# EAGLE board Prototyping-Board (EAGLE 5.11)
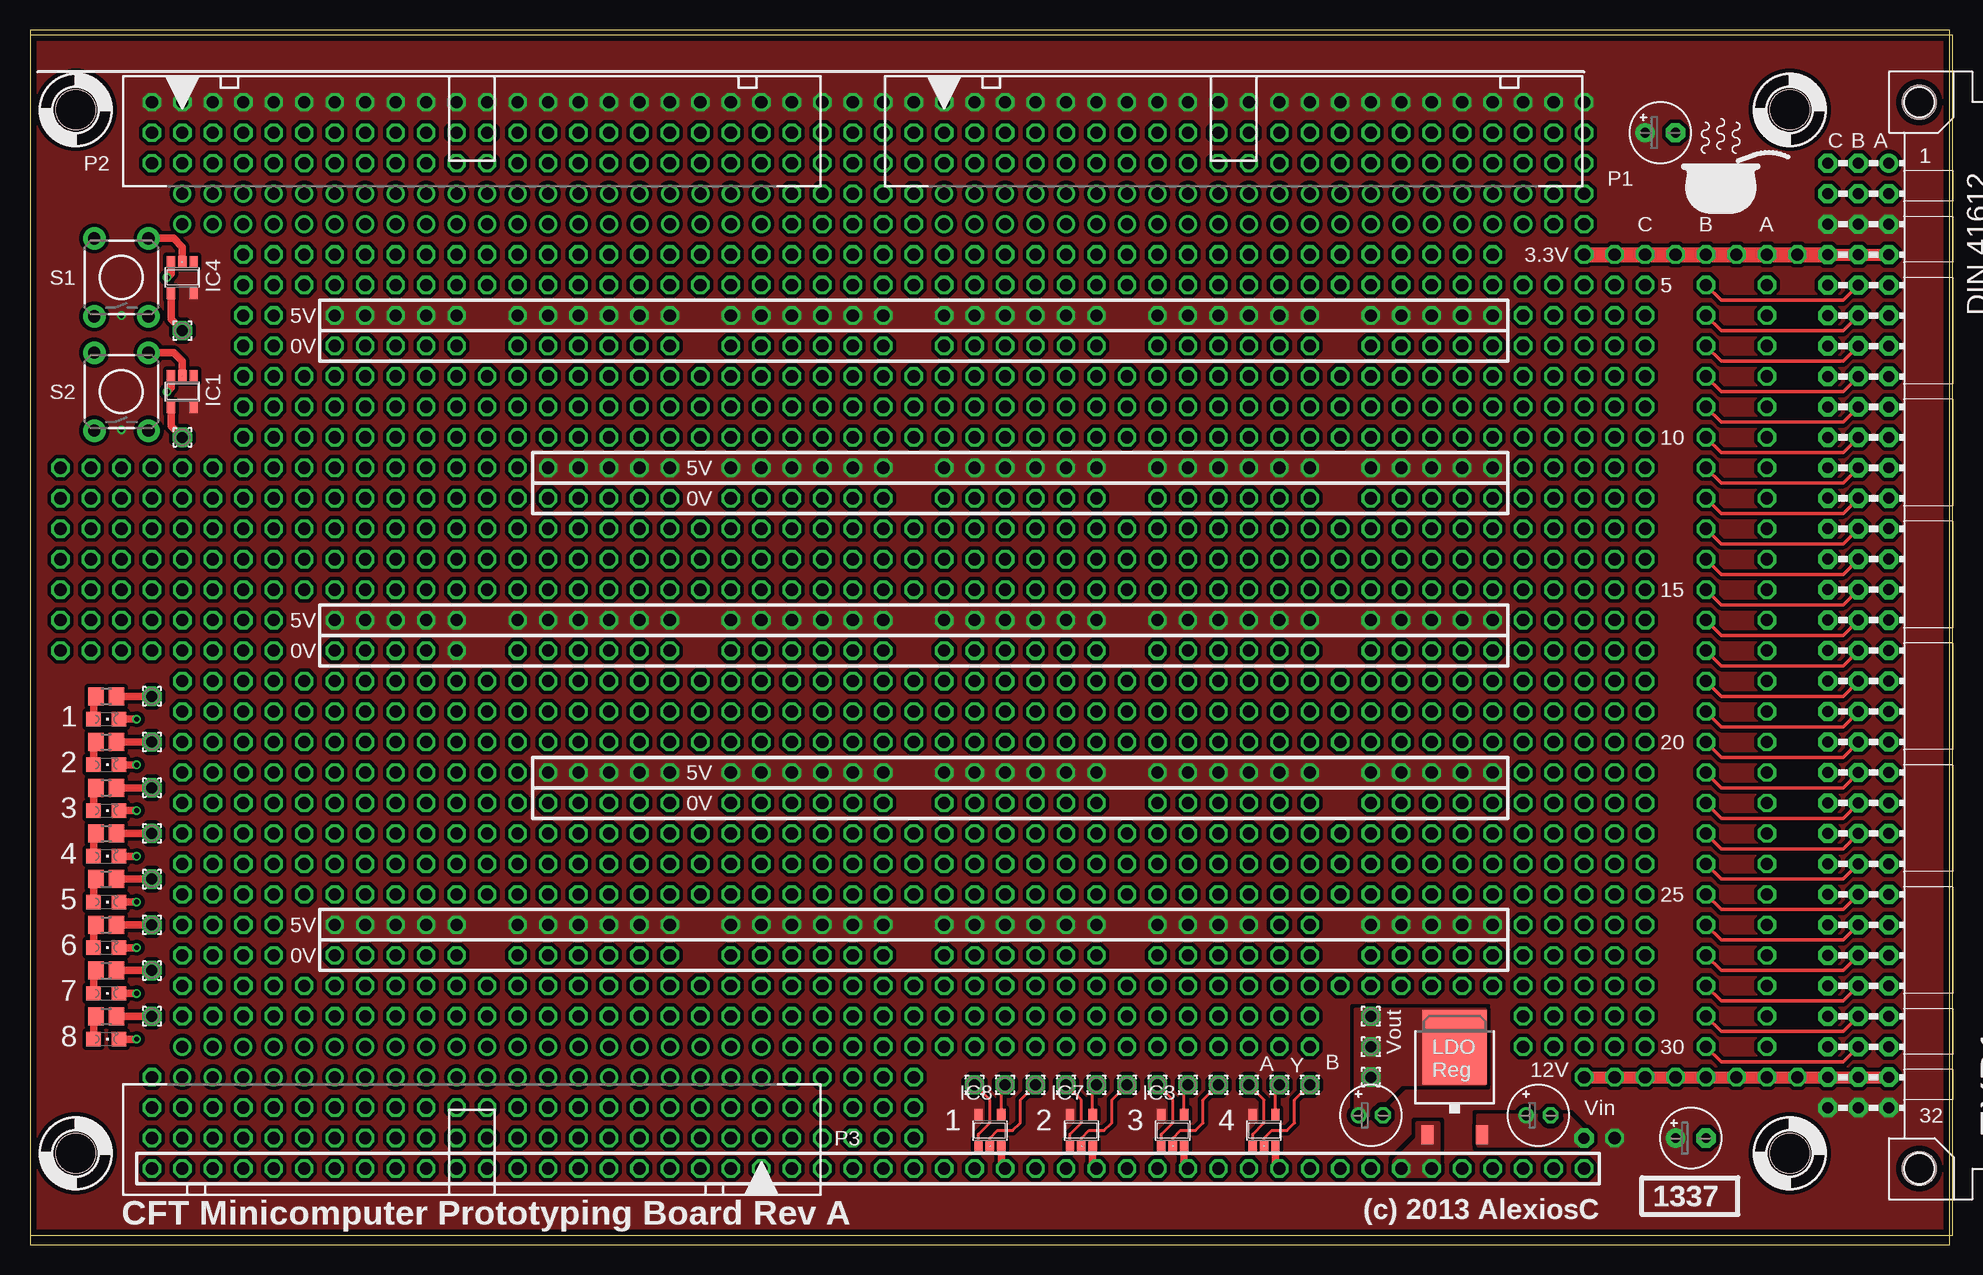
[diagram p5: board, top side]
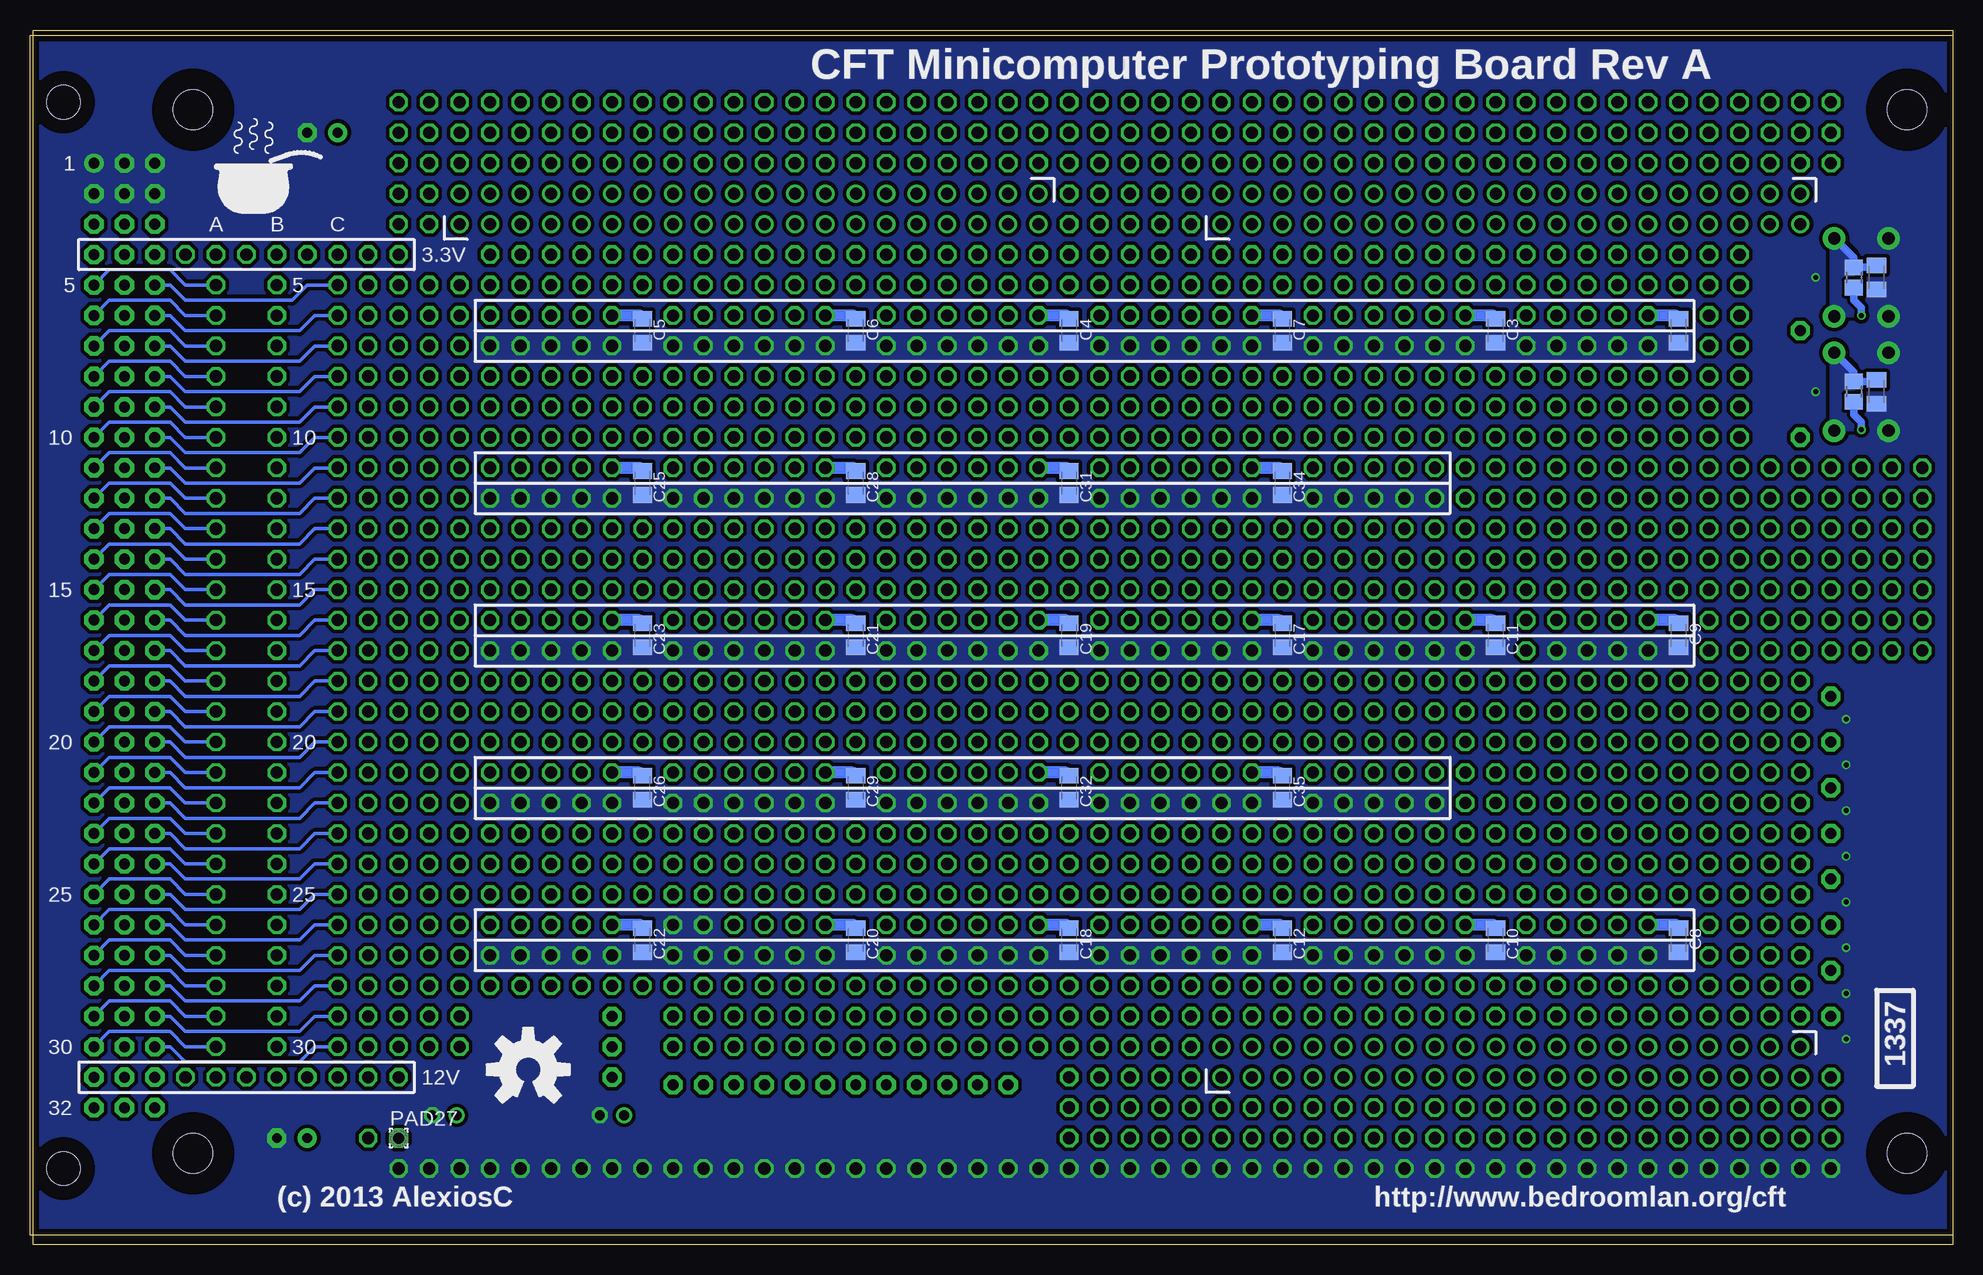
[diagram p6: board, bottom side, seen from below]

Size 160 x 101.27 mm. Coordinates in mm from the lower left corner, seen from the top.
Outline: 0,0 160,0 160,101.27 0,101.27 0,0
Copper layers (1*16): Top 0.035mm / dielectric 1.5mm / Bottom 0.035mm
Design rules "smart-prototyping *": minimum track width 7mil, minimum drill 12mil, track to track 7mil, track to pad 7mil, pad to pad 7mil, via to via 7mil, smd to smd 0mil, copper to edge 20mil, drill to drill 10mil, minimum pad ring 10mil, minimum via ring 6mil, stop-mask expansion 2mil, vias tented up to drill 25mil, thermal gap 10mil
Net classes: 0 default: width 0.254 mm, clearance 0.152 mm; 1 low power: width 0.254 mm, clearance 0.152 mm; 2 Power rails: width 0.61 mm, clearance 0.152 mm

## Footprints (pad centres in the part's own frame; a part is rotated, then mirrored left to right if it is on the bottom)
C0805K = smd 1.3 x 1.6: 1 -1,0; 2 1,0
E2,5-5 = drill 0.813 pad 1.6 round: + -1.27,0 | drill 0.813 pad 1.6 octagon: - 1.27,0
E2-5 = drill 0.813 pad 1.27 round: + -1.016,0 | drill 0.813 pad 1.27 octagon: - 1.016,0
VG96K = drill 0.914 pad 1.6 round: A1 154.94,39.37 | drill 0.914 pad 1.6 octagon: A2 154.94,36.83; A3 154.94,34.29; A4 154.94,31.75; A5 154.94,29.21; A6 154.94,26.67; A7 154.94,24.13; A8 154.94,21.59; A9 154.94,19.05; A10 154.94,16.51; A11 154.94,13.97; A12 154.94,11.43; A13 154.94,8.89; A14 154.94,6.35; A15 154.94,3.81; A16 154.94,1.27; A17 154.94,-1.27; A18 154.94,-3.81; A19 154.94,-6.35; A20 154.94,-8.89; A21 154.94,-11.43; A22 154.94,-13.97; A23 154.94,-16.51; A24 154.94,-19.05; A25 154.94,-21.59; A26 154.94,-24.13; A27 154.94,-26.67; A28 154.94,-29.21; A29 154.94,-31.75; A30 154.94,-34.29; A31 154.94,-36.83; A32 154.94,-39.37; B1 152.4,39.37; B2 152.4,36.83; B3 152.4,34.29; B4 152.4,31.75; B5 152.4,29.21; B6 152.4,26.67; B7 152.4,24.13; B8 152.4,21.59; B9 152.4,19.05; B10 152.4,16.51; B11 152.4,13.97; B12 152.4,11.43; B13 152.4,8.89; B14 152.4,6.35; B15 152.4,3.81; B16 152.4,1.27; B17 152.4,-1.27; B18 152.4,-3.81; B19 152.4,-6.35; B20 152.4,-8.89; B21 152.4,-11.43; B22 152.4,-13.97; B23 152.4,-16.51; B24 152.4,-19.05; B25 152.4,-21.59; B26 152.4,-24.13; B27 152.4,-26.67; B28 152.4,-29.21; B29 152.4,-31.75; B30 152.4,-34.29; B31 152.4,-36.83; B32 152.4,-39.37; C1 149.86,39.37; C2 149.86,36.83; C3 149.86,34.29; C4 149.86,31.75; C5 149.86,29.21; C6 149.86,26.67; C7 149.86,24.13; C8 149.86,21.59; C9 149.86,19.05; C10 149.86,16.51; C11 149.86,13.97; C12 149.86,11.43; C13 149.86,8.89; C14 149.86,6.35; C15 149.86,3.81; C16 149.86,1.27; C17 149.86,-1.27; C18 149.86,-3.81; C19 149.86,-6.35; C20 149.86,-8.89; C21 149.86,-11.43; C22 149.86,-13.97; C23 149.86,-16.51; C24 149.86,-19.05; C25 149.86,-21.59; C26 149.86,-24.13; C27 149.86,-26.67; C28 149.86,-29.21; C29 149.86,-31.75; C30 149.86,-34.29; C31 149.86,-36.83; C32 149.86,-39.37 | hole 2.794: 157.48,44.45; 157.48,-44.45
SOT23-5 = smd 0.69 x 0.99: 1 -0.95,-1.29; 2 0,-1.29; 3 0.95,-1.29; 4 0.95,1.3; 5 -0.95,1.3
TO252 = smd 1 x 1.6: 1 -2.28,-4.8; 2 2.28,-4.8 | smd 5.4 x 6.2: 3 0,2.5
CHIPLED_0805 = smd 1.2 x 1.2: A 0,-1.05; C 0,1.05
PAK100/2500-5-40 = drill 1 pad 1.422 round: 1 -24.13,-1.27; 2 -24.13,1.27; 3 -21.59,-1.27; 4 -21.59,1.27; 5 -19.05,-1.27; 6 -19.05,1.27; 7 -16.51,-1.27; 8 -16.51,1.27; 9 -13.97,-1.27; 10 -13.97,1.27; 11 -11.43,-1.27; 12 -11.43,1.27; 13 -8.89,-1.27; 14 -8.89,1.27; 15 -6.35,-1.27; 16 -6.35,1.27; 17 -3.81,-1.27; 18 -3.81,1.27; 19 -1.27,-1.27; 20 -1.27,1.27; 21 1.27,-1.27; 22 1.27,1.27; 23 3.81,-1.27; 24 3.81,1.27; 25 6.35,-1.27; 26 6.35,1.27; 27 8.89,-1.27; 28 8.89,1.27; 29 11.43,-1.27; 30 11.43,1.27; 31 13.97,-1.27; 32 13.97,1.27; 33 16.51,-1.27; 34 16.51,1.27; 35 19.05,-1.27; 36 19.05,1.27; 37 21.59,-1.27; 38 21.59,1.27; 39 24.13,-1.27; 40 24.13,1.27
PAD-8X1 = drill 1.016 octagon: 1 0,0; 2 2.54,0; 3 5.08,0; 4 7.62,0; 5 10.16,0; 6 12.7,0; 7 15.24,0; 8 17.78,0
PAD-4X1 = drill 1.016 octagon: 1 0,0; 2 2.54,0; 3 5.08,0; 4 7.62,0
PAD-1X1 = drill 1.016 octagon: 1 0,0
PAD-8X2 = drill 1.016 octagon: 1 0,0; 2 2.54,0; 3 5.08,0; 4 7.62,0; 5 10.16,0; 6 12.7,0; 7 15.24,0; 8 17.78,0; 9 0,2.54; 10 2.54,2.54; 11 5.08,2.54; 12 7.62,2.54; 13 10.16,2.54; 14 12.7,2.54; 15 15.24,2.54; 16 17.78,2.54
1,6/0,9 = drill 0.914 pad 1.6 octagon: 1 0,0
R0805 = smd 1.3 x 1.5: 1 -0.85,0; 2 0.85,0
TACTILE-PTH = drill 1.016 pad 1.88 round: 1 -3.251,2.261; 2 3.251,2.261; 3 -3.251,-2.261; 4 3.251,-2.261
STANDOFF_28_60 = hole 3.302: 0,0
PAD-1X2 = drill 1.016 octagon: 1 0,0; 2 2.54,0

## Placement (x,y rotation side)
$4_37_$  SIGNATURESILK  [SIGNATURE]  138.05,85.72 0 top
$4_37_$1  SIGNATURESILK  [SIGNATURE]  144.53,85.72 0 bottom
$4_39_$1  OSHW-LOGOL  [OSHW-LOGO-L]  118.75,14.61 0 bottom
C1  0.1uF  [C0805K]  6.35,71.12 90 bottom
C2  [C0805K]  22.86,76.2 270 bottom
C3  [C0805K]  38.1,76.2 270 bottom
C4  [C0805K]  73.66,76.2 270 bottom
C5  [C0805K]  109.22,76.2 270 bottom
C6  [C0805K]  91.44,76.2 270 bottom
C7  [C0805K]  55.88,76.2 270 bottom
C8  [C0805K]  22.86,25.4 270 bottom
C9  [C0805K]  22.86,50.8 270 bottom
C10  [C0805K]  38.1,25.4 270 bottom
C11  [C0805K]  38.1,50.8 270 bottom
C12  [C0805K]  55.88,25.4 270 bottom
C13  0.1uF  [C0805K]  6.35,80.64 90 bottom
C14  47uF  [E2,5-5]  138.43,8.89 0 top
C15  10uF  [E2-5]  125.73,10.79 0 top
C16  22uF  [E2-5]  111.76,10.79 0 top
C17  [C0805K]  55.88,50.8 270 bottom
C18  [C0805K]  73.66,25.4 270 bottom
C19  [C0805K]  73.66,50.8 270 bottom
C20  [C0805K]  91.44,25.4 270 bottom
C21  [C0805K]  91.44,50.8 270 bottom
C22  [C0805K]  109.22,25.4 270 bottom
C23  [C0805K]  109.22,50.8 270 bottom
C25  [C0805K]  109.22,63.5 270 bottom
C26  [C0805K]  109.22,38.1 270 bottom
C28  [C0805K]  91.44,63.5 270 bottom
C29  [C0805K]  91.44,38.1 270 bottom
C31  [C0805K]  73.66,63.5 270 bottom
C32  [C0805K]  73.66,38.1 270 bottom
C34  [C0805K]  55.88,63.5 270 bottom
C35  [C0805K]  55.88,38.1 270 bottom
C57  47uF  [E2,5-5]  135.89,92.71 0 top
EXP1  [VG96K]  0,50.8 0 top
IC1  74AHC1G14DBV  [SOT23-5]  12.7,71.12 180 top
IC2  74AHC1G00DBV  [SOT23-5]  102.87,9.53 0 top
IC3  74AHC1G00DBV  [SOT23-5]  95.25,9.53 0 top
IC4  74AHC1G14DBV  [SOT23-5]  12.7,80.64 180 top
IC5  AP1117D18  [TO252]  118.75,13.97 0 top
IC7  74AHC1G00DBV  [SOT23-5]  87.63,9.53 0 top
IC8  74AHC1G00DBV  [SOT23-5]  80.01,9.53 0 top
LED1  LED-5MM-GREEN  [CHIPLED_0805]  6.35,40.01 270 top
LED2  LED-5MM-GREEN  [CHIPLED_0805]  6.35,43.82 270 top
LED3  LED-5MM-GREEN  [CHIPLED_0805]  6.35,36.2 270 top
LED4  LED-5MM-GREEN  [CHIPLED_0805]  6.35,32.38 270 top
LED5  LED-5MM-GREEN  [CHIPLED_0805]  6.35,28.57 270 top
LED6  LED-5MM-GREEN  [CHIPLED_0805]  6.35,24.77 270 top
LED7  LED-5MM-GREEN  [CHIPLED_0805]  6.35,20.95 270 top
LED8  LED-5MM-GREEN  [CHIPLED_0805]  6.35,17.14 270 top
P1  2540-5  [PAK100/2500-5-40]  100.33,86.36 0 top
P2  2540-5  [PAK100/2500-5-40]  36.83,86.36 0 top
P3  2540-5  [PAK100/2500-5-40]  36.83,15.24 180 top
P4  PROTOTYPING-PAD-1X8  [PAD-8X1]  144.78,80.01 270 top
P5  PROTOTYPING-PAD-1X8  [PAD-8X1]  144.78,41.91 270 top
P6  PROTOTYPING-PAD-1X4  [PAD-4X1]  144.78,59.69 270 top
P7  PROTOTYPING-PAD-1X1  [PAD-1X1]  144.78,49.53 0 top
P8  PROTOTYPING-PAD-1X1  [PAD-1X1]  144.78,46.99 0 top
P9  PROTOTYPING-PAD-1X1  [PAD-1X1]  144.78,44.45 0 top
P10  PROTOTYPING-PAD-1X1  [PAD-1X1]  144.78,21.59 0 top
P11  PROTOTYPING-PAD-1X1  [PAD-1X1]  144.78,19.05 0 top
P12  PROTOTYPING-PAD-1X1  [PAD-1X1]  144.78,16.51 0 top
P13  PROTOTYPING-PAD-1X8  [PAD-8X1]  129.54,13.97 0 top
P14  PROTOTYPING-PAD-1X8  [PAD-8X1]  129.54,82.55 0 top
P15  PROTOTYPING-PAD-1X8  [PAD-8X1]  139.7,80.01 270 top
P16  PROTOTYPING-PAD-1X8  [PAD-8X1]  139.7,41.91 270 top
P17  PROTOTYPING-PAD-1X4  [PAD-4X1]  139.7,59.69 270 top
P18  PROTOTYPING-PAD-1X1  [PAD-1X1]  139.7,49.53 0 top
P19  PROTOTYPING-PAD-1X1  [PAD-1X1]  139.7,46.99 0 top
P20  PROTOTYPING-PAD-1X1  [PAD-1X1]  139.7,44.45 0 top
P21  PROTOTYPING-PAD-1X1  [PAD-1X1]  139.7,21.59 0 top
P22  PROTOTYPING-PAD-1X1  [PAD-1X1]  139.7,19.05 0 top
P23  PROTOTYPING-PAD-1X1  [PAD-1X1]  139.7,16.51 0 top
P24  PROTOTYPING-PAD-1X8  [PAD-8X1]  134.62,80.01 270 top
P25  PROTOTYPING-PAD-1X8  [PAD-8X1]  134.62,41.91 270 top
P26  PROTOTYPING-PAD-1X4  [PAD-4X1]  134.62,59.69 270 top
P27  PROTOTYPING-PAD-1X1  [PAD-1X1]  134.62,49.53 0 top
P28  PROTOTYPING-PAD-1X1  [PAD-1X1]  134.62,46.99 0 top
P29  PROTOTYPING-PAD-1X1  [PAD-1X1]  134.62,44.45 0 top
P30  PROTOTYPING-PAD-1X1  [PAD-1X1]  134.62,21.59 0 top
P31  PROTOTYPING-PAD-1X1  [PAD-1X1]  134.62,19.05 0 top
P32  PROTOTYPING-PAD-1X1  [PAD-1X1]  134.62,16.51 0 top
P33  PROTOTYPING-PAD-1X4  [PAD-4X1]  25.4,26.67 0 top
P34  PROTOTYPING-PAD-1X4  [PAD-4X1]  40.64,26.67 0 top
P35  PROTOTYPING-PAD-1X4  [PAD-4X1]  58.42,26.67 0 top
P36  PROTOTYPING-PAD-1X4  [PAD-4X1]  76.2,26.67 0 top
P37  PROTOTYPING-PAD-1X4  [PAD-4X1]  93.98,26.67 0 top
P38  PROTOTYPING-PAD-1X4  [PAD-4X1]  111.76,26.67 0 top
P39  PROTOTYPING-PAD-1X4  [PAD-4X1]  111.76,52.07 0 top
P40  PROTOTYPING-PAD-1X4  [PAD-4X1]  25.4,77.47 0 top
P41  PROTOTYPING-PAD-1X4  [PAD-4X1]  40.64,77.47 0 top
P42  PROTOTYPING-PAD-1X4  [PAD-4X1]  58.42,77.47 0 top
P43  PROTOTYPING-PAD-1X8  [PAD-8X1]  22.86,72.39 0 top
P44  PROTOTYPING-PAD-1X8  [PAD-8X1]  43.18,72.39 0 top
P45  PROTOTYPING-PAD-1X8  [PAD-8X1]  63.5,72.39 0 top
P46  PROTOTYPING-PAD-1X8  [PAD-8X1]  83.82,72.39 0 top
P47  PROTOTYPING-PAD-1X8  [PAD-8X1]  104.14,72.39 0 top
P48  PROTOTYPING-PAD-1X8  [PAD-8X1]  22.86,69.85 0 top
P49  PROTOTYPING-PAD-1X8  [PAD-8X1]  43.18,69.85 0 top
P50  PROTOTYPING-PAD-1X8  [PAD-8X1]  63.5,69.85 0 top
P51  PROTOTYPING-PAD-1X8  [PAD-8X1]  83.82,69.85 0 top
P52  PROTOTYPING-PAD-1X8  [PAD-8X1]  104.14,69.85 0 top
P53  PROTOTYPING-PAD-1X8  [PAD-8X1]  22.86,80.01 0 top
P54  PROTOTYPING-PAD-1X8  [PAD-8X1]  43.18,80.01 0 top
P55  PROTOTYPING-PAD-1X8  [PAD-8X1]  63.5,80.01 0 top
P56  PROTOTYPING-PAD-1X8  [PAD-8X1]  83.82,80.01 0 top
P57  PROTOTYPING-PAD-1X8  [PAD-8X1]  104.14,80.01 0 top
P58  PROTOTYPING-PAD-1X8  [PAD-8X1]  22.86,82.55 0 top
P59  PROTOTYPING-PAD-1X8  [PAD-8X1]  43.18,82.55 0 top
P60  PROTOTYPING-PAD-1X8  [PAD-8X1]  63.5,82.55 0 top
P61  PROTOTYPING-PAD-1X8  [PAD-8X1]  83.82,82.55 0 top
P62  PROTOTYPING-PAD-1X8  [PAD-8X1]  104.14,82.55 0 top
P63  PROTOTYPING-PAD-1X4  [PAD-4X1]  76.2,77.47 0 top
P64  PROTOTYPING-PAD-1X4  [PAD-4X1]  93.98,77.47 0 top
P65  PROTOTYPING-PAD-1X4  [PAD-4X1]  93.98,52.07 0 top
P66  PROTOTYPING-PAD-1X4  [PAD-4X1]  111.76,77.47 0 top
P67  PROTOTYPING-PAD-1X4  [PAD-4X1]  76.2,52.07 0 top
P68  PROTOTYPING-PAD-1X4  [PAD-4X1]  58.42,52.07 0 top
P69  PROTOTYPING-PAD-1X4  [PAD-4X1]  40.64,52.07 0 top
P70  PROTOTYPING-PAD-1X4  [PAD-4X1]  25.4,52.07 0 top
P71  PROTOTYPING-PAD-1X4  [PAD-4X1]  25.4,74.93 0 top
P72  PROTOTYPING-PAD-1X4  [PAD-4X1]  40.64,74.93 0 top
P73  PROTOTYPING-PAD-1X8  [PAD-8X1]  104.14,67.31 0 top
P74  PROTOTYPING-PAD-1X8  [PAD-8X1]  83.82,67.31 0 top
P75  PROTOTYPING-PAD-1X8  [PAD-8X1]  63.5,67.31 0 top
P76  PROTOTYPING-PAD-1X8  [PAD-8X1]  43.18,54.61 0 top
P77  PROTOTYPING-PAD-1X4  [PAD-4X1]  58.42,74.93 0 top
P78  PROTOTYPING-PAD-1X8  [PAD-8X1]  22.86,54.61 0 top
P79  PROTOTYPING-PAD-1X8  [PAD-8X1]  43.18,67.31 0 top
P80  PROTOTYPING-PAD-1X8  [PAD-8X1]  22.86,59.69 0 top
P81  PROTOTYPING-PAD-1X8  [PAD-8X1]  43.18,59.69 0 top
P82  PROTOTYPING-PAD-1X8  [PAD-8X1]  63.5,59.69 0 top
P83  PROTOTYPING-PAD-1X8  [PAD-8X1]  83.82,59.69 0 top
P84  PROTOTYPING-PAD-1X8  [PAD-8X1]  104.14,59.69 0 top
P85  PROTOTYPING-PAD-1X8  [PAD-8X1]  22.86,57.15 0 top
P86  PROTOTYPING-PAD-1X8  [PAD-8X1]  43.18,57.15 0 top
P87  PROTOTYPING-PAD-1X8  [PAD-8X1]  63.5,57.15 0 top
P88  PROTOTYPING-PAD-1X8  [PAD-8X1]  104.14,57.15 0 top
P89  PROTOTYPING-PAD-1X8  [PAD-8X1]  83.82,57.15 0 top
P90  PROTOTYPING-PAD-1X8  [PAD-8X1]  104.14,54.61 0 top
P91  PROTOTYPING-PAD-1X8  [PAD-8X1]  63.5,54.61 0 top
P92  PROTOTYPING-PAD-1X8  [PAD-8X1]  83.82,54.61 0 top
P93  PROTOTYPING-PAD-1X4  [PAD-4X1]  76.2,74.93 0 top
P94  PROTOTYPING-PAD-1X4  [PAD-4X1]  93.98,74.93 0 top
P95  PROTOTYPING-PAD-1X4  [PAD-4X1]  111.76,74.93 0 top
P96  PROTOTYPING-PAD-1X4  [PAD-4X1]  93.98,62.23 0 top
P97  PROTOTYPING-PAD-1X4  [PAD-4X1]  40.64,49.53 0 top
P98  PROTOTYPING-PAD-1X4  [PAD-4X1]  58.42,49.53 0 top
P99  PROTOTYPING-PAD-1X4  [PAD-4X1]  76.2,49.53 0 top
P100  PROTOTYPING-PAD-1X4  [PAD-4X1]  93.98,49.53 0 top
P101  PROTOTYPING-PAD-1X4  [PAD-4X1]  111.76,49.53 0 top
P102  PROTOTYPING-PAD-1X4  [PAD-4X1]  25.4,24.13 0 top
P103  PROTOTYPING-PAD-1X8  [PAD-8X1]  104.14,34.29 0 top
P104  PROTOTYPING-PAD-1X8  [PAD-8X1]  22.86,46.99 0 top
P105  PROTOTYPING-PAD-1X8  [PAD-8X1]  83.82,46.99 0 top
P106  PROTOTYPING-PAD-1X8  [PAD-8X1]  63.5,46.99 0 top
P107  PROTOTYPING-PAD-1X8  [PAD-8X1]  43.18,46.99 0 top
P108  PROTOTYPING-PAD-1X8  [PAD-8X1]  104.14,46.99 0 top
P109  PROTOTYPING-PAD-1X8  [PAD-8X1]  22.86,44.45 0 top
P110  PROTOTYPING-PAD-1X8  [PAD-8X1]  43.18,44.45 0 top
P111  PROTOTYPING-PAD-1X8  [PAD-8X1]  63.5,44.45 0 top
P112  PROTOTYPING-PAD-1X8  [PAD-8X1]  83.82,44.45 0 top
P113  PROTOTYPING-PAD-1X8  [PAD-8X1]  104.14,44.45 0 top
P114  PROTOTYPING-PAD-1X8  [PAD-8X1]  22.86,41.91 0 top
P115  PROTOTYPING-PAD-1X8  [PAD-8X1]  43.18,41.91 0 top
P116  PROTOTYPING-PAD-1X8  [PAD-8X1]  63.5,41.91 0 top
P117  PROTOTYPING-PAD-1X8  [PAD-8X1]  83.82,41.91 0 top
P118  PROTOTYPING-PAD-1X8  [PAD-8X1]  104.14,41.91 0 top
P119  PROTOTYPING-PAD-1X8  [PAD-8X1]  22.86,34.29 0 top
P120  PROTOTYPING-PAD-1X8  [PAD-8X1]  43.18,34.29 0 top
P121  PROTOTYPING-PAD-1X8  [PAD-8X1]  63.5,34.29 0 top
P122  PROTOTYPING-PAD-1X8  [PAD-8X1]  83.82,34.29 0 top
P123  PROTOTYPING-PAD-1X4  [PAD-4X1]  40.64,24.13 0 top
P124  PROTOTYPING-PAD-1X4  [PAD-4X1]  58.42,24.13 0 top
P125  PROTOTYPING-PAD-1X4  [PAD-4X1]  76.2,24.13 0 top
P126  PROTOTYPING-PAD-1X4  [PAD-4X1]  93.98,24.13 0 top
P127  PROTOTYPING-PAD-1X4  [PAD-4X1]  111.76,24.13 0 top
P128  PROTOTYPING-PAD-1X4  [PAD-4X1]  43.18,64.77 0 top
P129  PROTOTYPING-PAD-1X4  [PAD-4X1]  58.42,64.77 0 top
P130  PROTOTYPING-PAD-1X4  [PAD-4X1]  76.2,64.77 0 top
P131  PROTOTYPING-PAD-1X4  [PAD-4X1]  93.98,64.77 0 top
P132  PROTOTYPING-PAD-1X4  [PAD-4X1]  111.76,64.77 0 top
P133  PROTOTYPING-PAD-1X8  [PAD-8X1]  22.86,31.75 0 top
P134  PROTOTYPING-PAD-1X8  [PAD-8X1]  43.18,31.75 0 top
P135  PROTOTYPING-PAD-1X8  [PAD-8X1]  63.5,31.75 0 top
P136  PROTOTYPING-PAD-1X8  [PAD-8X1]  83.82,31.75 0 top
P137  PROTOTYPING-PAD-1X8  [PAD-8X1]  104.14,31.75 0 top
P138  PROTOTYPING-PAD-1X8  [PAD-8X1]  22.86,29.21 0 top
P139  PROTOTYPING-PAD-1X8  [PAD-8X1]  43.18,29.21 0 top
P140  PROTOTYPING-PAD-1X8  [PAD-8X1]  63.5,29.21 0 top
P141  PROTOTYPING-PAD-1X8  [PAD-8X1]  83.82,29.21 0 top
P142  PROTOTYPING-PAD-1X8  [PAD-8X1]  104.14,29.21 0 top
P143  PROTOTYPING-PAD-1X8  [PAD-8X1]  22.86,67.31 0 top
P144  PROTOTYPING-PAD-1X8  [PAD-8X1]  22.86,64.77 0 top
P145  PROTOTYPING-PAD-1X8  [PAD-8X1]  22.86,62.23 0 top
P146  PROTOTYPING-PAD-1X8  [PAD-8X1]  22.86,36.83 0 top
P147  PROTOTYPING-PAD-1X8  [PAD-8X1]  22.86,39.37 0 top
P148  PROTOTYPING-PAD-1X8  [PAD-8X1]  22.86,21.59 0 top
P149  PROTOTYPING-PAD-1X8  [PAD-8X1]  63.5,21.59 0 top
P150  PROTOTYPING-PAD-1X8  [PAD-8X1]  43.18,21.59 0 top
P151  PROTOTYPING-PAD-1X8  [PAD-8X1]  83.82,21.59 0 top
P152  PROTOTYPING-PAD-1X8  [PAD-8X1]  104.14,21.59 0 top
P153  PROTOTYPING-PAD-1X4  [PAD-4X1]  43.18,62.23 0 top
P154  PROTOTYPING-PAD-1X4  [PAD-4X1]  58.42,62.23 0 top
P155  PROTOTYPING-PAD-1X4  [PAD-4X1]  76.2,62.23 0 top
P156  PROTOTYPING-PAD-1X4  [PAD-4X1]  25.4,49.53 0 top
P157  PROTOTYPING-PAD-1X4  [PAD-4X1]  111.76,62.23 0 top
P158  PROTOTYPING-PAD-1X4  [PAD-4X1]  43.18,39.37 0 top
P159  PROTOTYPING-PAD-1X4  [PAD-4X1]  58.42,39.37 0 top
P160  PROTOTYPING-PAD-1X4  [PAD-4X1]  124.46,80.01 0 top
P161  PROTOTYPING-PAD-1X4  [PAD-4X1]  124.46,77.47 0 top
P162  PROTOTYPING-PAD-1X4  [PAD-4X1]  124.46,74.93 0 top
P163  PROTOTYPING-PAD-1X4  [PAD-4X1]  124.46,72.39 0 top
P164  PROTOTYPING-PAD-1X4  [PAD-4X1]  124.46,69.85 0 top
P165  PROTOTYPING-PAD-1X4  [PAD-4X1]  124.46,67.31 0 top
P166  PROTOTYPING-PAD-1X4  [PAD-4X1]  124.46,64.77 0 top
P167  PROTOTYPING-PAD-1X4  [PAD-4X1]  124.46,62.23 0 top
P168  PROTOTYPING-PAD-1X4  [PAD-4X1]  124.46,59.69 0 top
P169  PROTOTYPING-PAD-1X4  [PAD-4X1]  124.46,57.15 0 top
P170  PROTOTYPING-PAD-1X4  [PAD-4X1]  124.46,54.61 0 top
P171  PROTOTYPING-PAD-1X4  [PAD-4X1]  124.46,52.07 0 top
P172  PROTOTYPING-PAD-1X4  [PAD-4X1]  124.46,49.53 0 top
P173  PROTOTYPING-PAD-1X4  [PAD-4X1]  124.46,46.99 0 top
P174  PROTOTYPING-PAD-1X4  [PAD-4X1]  124.46,44.45 0 top
P175  PROTOTYPING-PAD-1X4  [PAD-4X1]  124.46,41.91 0 top
P176  PROTOTYPING-PAD-1X4  [PAD-4X1]  124.46,39.37 0 top
P177  PROTOTYPING-PAD-1X4  [PAD-4X1]  124.46,36.83 0 top
P178  PROTOTYPING-PAD-1X4  [PAD-4X1]  124.46,34.29 0 top
P179  PROTOTYPING-PAD-1X4  [PAD-4X1]  124.46,31.75 0 top
P180  PROTOTYPING-PAD-1X4  [PAD-4X1]  124.46,29.21 0 top
P181  PROTOTYPING-PAD-1X4  [PAD-4X1]  124.46,16.51 0 top
P182  PROTOTYPING-PAD-1X4  [PAD-4X1]  124.46,26.67 0 top
P183  PROTOTYPING-PAD-1X4  [PAD-4X1]  124.46,24.13 0 top
P184  PROTOTYPING-PAD-1X4  [PAD-4X1]  124.46,21.59 0 top
P185  PROTOTYPING-PAD-1X4  [PAD-4X1]  124.46,19.05 0 top
P186  PROTOTYPING-PAD-1X4  [PAD-4X1]  76.2,39.37 0 top
P187  PROTOTYPING-PAD-1X4  [PAD-4X1]  93.98,39.37 0 top
P188  PROTOTYPING-PAD-1X4  [PAD-4X1]  111.76,39.37 0 top
P189  PROTOTYPING-PAD-1X4  [PAD-4X1]  43.18,36.83 0 top
P190  PROTOTYPING-PAD-1X4  [PAD-4X1]  58.42,36.83 0 top
P191  PROTOTYPING-PAD-1X4  [PAD-4X1]  76.2,36.83 0 top
P192  PROTOTYPING-PAD-1X4  [PAD-4X1]  93.98,36.83 0 top
P193  PROTOTYPING-PAD-1X4  [PAD-4X1]  111.76,36.83 0 top
P194  PROTOTYPING-PAD-1X1  [PAD-1X1]  121.92,77.47 0 top
P195  PROTOTYPING-PAD-1X1  [PAD-1X1]  121.92,64.77 0 top
P196  PROTOTYPING-PAD-1X1  [PAD-1X1]  132.08,8.89 0 top
P197  PROTOTYPING-PAD-1X8  [PAD-8X1]  15.24,46.99 270 top
P198  PROTOTYPING-PAD-1X8  [PAD-8X1]  12.7,46.99 270 top
P199  PROTOTYPING-PAD-1X8  [PAD-8X1]  17.78,46.99 270 top
P200  PROTOTYPING-PAD-1X8  [PAD-8X1]  20.32,46.99 270 top
P201  PROTOTYPING-PAD-1X4  [PAD-4X1]  12.7,26.67 0 top
P202  PROTOTYPING-PAD-1X4  [PAD-4X1]  12.7,24.13 0 top
P203  PROTOTYPING-PAD-1X4  [PAD-4X1]  12.7,21.59 0 top
P204  PROTOTYPING-PAD-1X4  [PAD-4X1]  12.7,19.05 0 top
P205  PROTOTYPING-PAD-1X8  [PAD-8X1]  22.86,19.05 0 top
P206  PROTOTYPING-PAD-1X8  [PAD-8X1]  43.18,19.05 0 top
P207  PROTOTYPING-PAD-2X8  [PAD-8X2]  63.5,16.51 0 top
P208  PROTOTYPING-PAD-2X8  [PAD-8X2]  83.82,16.51 0 top
P209  PROTOTYPING-PAD-1X1  [PAD-1X1]  104.14,19.05 0 top
P210  PROTOTYPING-PAD-1X1  [PAD-1X1]  106.68,19.05 0 top
P211  PROTOTYPING-PAD-1X8  [PAD-8X1]  20.32,82.55 270 top
P212  PROTOTYPING-PAD-1X8  [PAD-8X1]  17.78,82.55 270 top
P213  PROTOTYPING-PAD-1X4  [PAD-4X1]  20.32,62.23 270 top
P214  PROTOTYPING-PAD-1X4  [PAD-4X1]  7.62,64.77 0 top
P215  PROTOTYPING-PAD-1X4  [PAD-4X1]  10.16,49.53 0 top
P216  PROTOTYPING-PAD-1X4  [PAD-4X1]  7.62,62.23 270 top
P217  PROTOTYPING-PAD-1X1  [PAD-1X1]  20.32,52.07 0 top
P218  PROTOTYPING-PAD-1X1  [PAD-1X1]  20.32,49.53 0 top
P219  PROTOTYPING-PAD-1X1  [PAD-1X1]  7.62,52.07 0 top
P220  PROTOTYPING-PAD-1X1  [PAD-1X1]  7.62,49.53 0 top
P221  PROTOTYPING-PAD-1X4  [PAD-4X1]  5.08,64.77 270 top
P222  PROTOTYPING-PAD-1X4  [PAD-4X1]  2.54,64.77 270 top
P223  PROTOTYPING-PAD-1X1  [PAD-1X1]  2.54,54.61 90 top
P224  PROTOTYPING-PAD-1X1  [PAD-1X1]  5.08,54.61 90 top
P225  PROTOTYPING-PAD-1X1  [PAD-1X1]  5.08,52.07 90 top
P226  PROTOTYPING-PAD-1X1  [PAD-1X1]  2.54,52.07 90 top
P227  PROTOTYPING-PAD-1X1  [PAD-1X1]  2.54,49.53 90 top
P228  PROTOTYPING-PAD-1X1  [PAD-1X1]  5.08,49.53 90 top
P229  PROTOTYPING-PAD-1X4  [PAD-4X1]  10.16,62.23 0 top
P230  PROTOTYPING-PAD-1X4  [PAD-4X1]  10.16,59.69 0 top
P231  PROTOTYPING-PAD-1X4  [PAD-4X1]  10.16,57.15 0 top
P232  PROTOTYPING-PAD-1X4  [PAD-4X1]  10.16,54.61 0 top
P233  PROTOTYPING-PAD-1X4  [PAD-4X1]  10.16,52.07 0 top
P234  PROTOTYPING-PAD-2X8  [PAD-8X2]  12.7,8.89 0 top
P235  PROTOTYPING-PAD-2X8  [PAD-8X2]  33.02,8.89 0 top
P236  PROTOTYPING-PAD-2X8  [PAD-8X2]  53.34,8.89 0 top
P237  PROTOTYPING-PAD-1X4  [PAD-4X1]  63.5,13.97 0 top
P238  PROTOTYPING-PAD-1X4  [PAD-4X1]  63.5,87.63 0 top
P239  PROTOTYPING-PAD-1X1  [PAD-1X1]  73.66,13.97 0 top
P240  PROTOTYPING-PAD-1X1  [PAD-1X1]  73.66,11.43 0 top
P241  PROTOTYPING-PAD-1X1  [PAD-1X1]  73.66,8.89 0 top
P242  PROTOTYPING-PAD-2X8  [PAD-8X2]  10.16,90.17 0 top
P243  PROTOTYPING-PAD-2X8  [PAD-8X2]  30.48,90.17 0 top
P244  PROTOTYPING-PAD-2X8  [PAD-8X2]  50.8,90.17 0 top
P245  PROTOTYPING-PAD-1X1  [PAD-1X1]  121.92,52.07 0 top
P246  PROTOTYPING-PAD-1X1  [PAD-1X1]  121.92,74.93 0 top
P247  PROTOTYPING-PAD-1X1  [PAD-1X1]  73.66,87.63 0 top
P248  PROTOTYPING-PAD-1X1  [PAD-1X1]  121.92,62.23 0 top
P249  PROTOTYPING-PAD-1X1  [PAD-1X1]  53.34,62.23 0 top
P250  PROTOTYPING-PAD-2X8  [PAD-8X2]  91.44,90.17 0 top
P251  PROTOTYPING-PAD-2X8  [PAD-8X2]  111.76,90.17 0 top
P252  PROTOTYPING-PAD-2X8  [PAD-8X2]  71.12,90.17 0 top
P253  PROTOTYPING-PAD-1X4  [PAD-4X1]  63.5,85.09 0 top
P254  PROTOTYPING-PAD-1X1  [PAD-1X1]  121.92,49.53 0 top
P255  PROTOTYPING-PAD-1X1  [PAD-1X1]  73.66,85.09 0 top
P256  PROTOTYPING-PAD-1X1  [PAD-1X1]  53.34,64.77 0 top
P257  PROTOTYPING-PAD-1X1  [PAD-1X1]  35.56,77.47 0 top
P258  PROTOTYPING-PAD-1X1  [PAD-1X1]  35.56,52.07 0 top
P259  PROTOTYPING-PAD-1X1  [PAD-1X1]  68.58,39.37 0 top
P260  PROTOTYPING-PAD-1X1  [PAD-1X1]  71.12,39.37 0 top
P261  PROTOTYPING-PAD-1X1  [PAD-1X1]  35.56,26.67 0 top
P262  PROTOTYPING-PAD-1X1  [PAD-1X1]  53.34,39.37 0 top
P263  PROTOTYPING-PAD-1X1  [PAD-1X1]  35.56,49.53 0 top
P264  PROTOTYPING-PAD-1X8  [PAD-8X1]  10.16,6.35 0 top
P265  PROTOTYPING-PAD-1X1  [PAD-1X1]  35.56,24.13 0 top
P266  PROTOTYPING-PAD-1X1  [PAD-1X1]  53.34,36.83 0 top
P267  PROTOTYPING-PAD-1X1  [PAD-1X1]  35.56,74.93 0 top
P268  PROTOTYPING-PAD-1X8  [PAD-8X1]  30.48,6.35 0 top
P269  PROTOTYPING-PAD-1X8  [PAD-8X1]  50.8,6.35 0 top
P270  PROTOTYPING-PAD-1X8  [PAD-8X1]  71.12,6.35 0 top
P271  PROTOTYPING-PAD-1X8  [PAD-8X1]  91.44,6.35 0 top
P272  PROTOTYPING-PAD-1X1  [PAD-1X1]  10.16,13.97 0 top
P273  PROTOTYPING-PAD-1X1  [PAD-1X1]  10.16,11.43 0 top
P274  PROTOTYPING-PAD-1X1  [PAD-1X1]  10.16,8.89 0 top
P275  PROTOTYPING-PAD-1X8  [PAD-8X1]  111.76,6.35 0 top
P276  PROTOTYPING-PAD-1X8  [PAD-8X1]  10.16,95.25 0 top
P277  PROTOTYPING-PAD-1X8  [PAD-8X1]  30.48,95.25 0 top
P278  PROTOTYPING-PAD-1X8  [PAD-8X1]  50.8,95.25 0 top
P279  PROTOTYPING-PAD-1X8  [PAD-8X1]  71.12,95.25 0 top
P280  PROTOTYPING-PAD-1X8  [PAD-8X1]  91.44,95.25 0 top
P281  PROTOTYPING-PAD-1X8  [PAD-8X1]  111.76,95.25 0 top
P282  PROTOTYPING-PAD-1X1  [PAD-1X1]  121.92,39.37 0 top
P283  PROTOTYPING-PAD-1X1  [PAD-1X1]  121.92,36.83 0 top
P284  PROTOTYPING-PAD-1X1  [PAD-1X1]  121.92,26.67 0 top
P285  PROTOTYPING-PAD-1X1  [PAD-1X1]  121.92,24.13 0 top
P286  PROTOTYPING-PAD-1X1  [PAD-1X1]  104.14,16.51 0 top
P287  PROTOTYPING-PAD-1X1  [PAD-1X1]  106.68,16.51 0 top
P288  PROTOTYPING-PAD-1X1  [PAD-1X1]  127,87.63 0 top
P289  PROTOTYPING-PAD-1X1  [PAD-1X1]  129.54,87.63 0 top
P290  PROTOTYPING-PAD-1X1  [PAD-1X1]  127,85.09 0 top
P291  PROTOTYPING-PAD-1X1  [PAD-1X1]  129.54,85.09 0 top
PAD1  [1,6/0,9]  10.16,45.72 0 top
PAD2  [1,6/0,9]  10.16,41.91 0 top
PAD3  [1,6/0,9]  10.16,38.1 0 top
PAD4  [1,6/0,9]  10.16,34.29 0 top
PAD5  [1,6/0,9]  10.16,30.48 0 top
PAD6  [1,6/0,9]  10.16,26.67 0 top
PAD7  [1,6/0,9]  10.16,22.86 0 top
PAD8  [1,6/0,9]  10.16,19.05 0 top
PAD9  [1,6/0,9]  12.7,76.2 0 top
PAD10  [1,6/0,9]  12.7,67.31 0 top
PAD11  [1,6/0,9]  111.76,16.51 0 top
PAD12  [1,6/0,9]  111.76,13.97 0 top
PAD16  [1,6/0,9]  101.6,13.33 90 top
PAD17  [1,6/0,9]  106.68,13.33 90 top
PAD18  [1,6/0,9]  104.14,13.33 90 top
PAD24  [1,6/0,9]  93.98,13.33 0 top
PAD25  [1,6/0,9]  99.06,13.33 0 top
PAD26  [1,6/0,9]  96.52,13.33 0 top
PAD27  [1,6/0,9]  129.54,8.89 0 bottom
PAD28  [1,6/0,9]  111.76,19.05 0 top
PAD33  [1,6/0,9]  86.36,13.33 0 top
PAD34  [1,6/0,9]  91.44,13.33 0 top
PAD35  [1,6/0,9]  88.9,13.33 0 top
PAD36  [1,6/0,9]  78.74,13.33 0 top
PAD37  [1,6/0,9]  83.82,13.33 0 top
PAD38  [1,6/0,9]  81.28,13.33 0 top
R1  50k  [R0805]  8.26,71.12 270 bottom
R2  330R  [R0805]  6.35,41.91 0 top
R3  330R  [R0805]  6.35,38.1 0 top
R4  330R  [R0805]  6.35,34.29 0 top
R5  330R  [R0805]  6.35,30.48 0 top
R6  330R  [R0805]  6.35,26.67 0 top
R7  330R  [R0805]  6.35,22.86 0 top
R8  330R  [R0805]  6.35,19.05 0 top
R9  50k  [R0805]  8.26,80.64 270 bottom
R10  330R  [R0805]  6.35,45.72 0 top
S1  [TACTILE-PTH]  7.62,80.64 90 top
S2  [TACTILE-PTH]  7.62,71.12 90 top
U1  HOLE  [STANDOFF_28_60]  3.81,94.61 0 top
U2  HOLE  [STANDOFF_28_60]  3.81,7.62 0 top
U3  HOLE  [STANDOFF_28_60]  146.69,94.61 0 top
U4  HOLE  [STANDOFF_28_60]  146.69,7.62 0 top
U$1  PROTOTYPING-PAD-1X2  [PAD-1X2]  50.8,26.67 0 top
U$2  PROTOTYPING-PAD-1X2  [PAD-1X2]  104.14,52.07 0 top
U$3  PROTOTYPING-PAD-1X2  [PAD-1X2]  86.36,52.07 0 top
U$4  PROTOTYPING-PAD-1X2  [PAD-1X2]  86.36,64.77 0 top
U$5  PROTOTYPING-PAD-1X2  [PAD-1X2]  68.58,52.07 0 top
U$6  PROTOTYPING-PAD-1X2  [PAD-1X2]  68.58,64.77 0 top
U$11  PROTOTYPING-PAD-1X2  [PAD-1X2]  104.14,64.77 0 top
U$12  PROTOTYPING-PAD-1X2  [PAD-1X2]  50.8,52.07 0 top
U$13  PROTOTYPING-PAD-1X2  [PAD-1X2]  68.58,62.23 0 top
U$14  PROTOTYPING-PAD-1X2  [PAD-1X2]  104.14,49.53 0 top
U$15  PROTOTYPING-PAD-1X2  [PAD-1X2]  86.36,49.53 0 top
U$16  PROTOTYPING-PAD-1X2  [PAD-1X2]  68.58,49.53 0 top
U$17  PROTOTYPING-PAD-1X2  [PAD-1X2]  50.8,49.53 0 top
U$18  PROTOTYPING-PAD-1X2  [PAD-1X2]  86.36,36.83 0 top
U$19  PROTOTYPING-PAD-1X2  [PAD-1X2]  104.14,36.83 0 top
U$20  PROTOTYPING-PAD-1X2  [PAD-1X2]  104.14,26.67 0 top
U$21  PROTOTYPING-PAD-1X2  [PAD-1X2]  86.36,26.67 0 top
U$23  PROTOTYPING-PAD-1X2  [PAD-1X2]  68.58,26.67 0 top
U$25  PROTOTYPING-PAD-1X2  [PAD-1X2]  104.14,39.37 0 top
U$27  PROTOTYPING-PAD-1X2  [PAD-1X2]  86.36,39.37 0 top
U$29  PROTOTYPING-PAD-1X2  [PAD-1X2]  68.58,36.83 0 top
U$31  PROTOTYPING-PAD-1X2  [PAD-1X2]  86.36,24.13 0 top
U$33  PROTOTYPING-PAD-1X2  [PAD-1X2]  104.14,24.13 0 top
U$35  PROTOTYPING-PAD-1X2  [PAD-1X2]  68.58,24.13 0 top
U$36  PROTOTYPING-PAD-1X2  [PAD-1X2]  50.8,24.13 0 top
U$37  PROTOTYPING-PAD-1X2  [PAD-1X2]  68.58,77.47 0 top
U$38  PROTOTYPING-PAD-1X2  [PAD-1X2]  50.8,77.47 0 top
U$39  PROTOTYPING-PAD-1X2  [PAD-1X2]  68.58,74.93 0 top
U$40  PROTOTYPING-PAD-1X2  [PAD-1X2]  50.8,74.93 0 top
U$41  PROTOTYPING-PAD-1X2  [PAD-1X2]  86.36,77.47 0 top
U$42  PROTOTYPING-PAD-1X2  [PAD-1X2]  86.36,74.93 0 top
U$43  PROTOTYPING-PAD-1X2  [PAD-1X2]  104.14,77.47 0 top
U$44  PROTOTYPING-PAD-1X2  [PAD-1X2]  104.14,74.93 0 top
U$45  PROTOTYPING-PAD-1X2  [PAD-1X2]  86.36,62.23 0 top
U$46  PROTOTYPING-PAD-1X2  [PAD-1X2]  104.14,62.23 0 top

## Tracks (layer width: path | path; a pad name or v marks a point on that pad's centre or on a via)
![R1]
  Top 0.305: P15.5 140.97,68.58 151.13,68.58 EXP1.B9
![R6]
  Top 0.305: P15.6 140.97,66.04 151.13,66.04 EXP1.B10
![R7]
  Top 0.305: P15.7 140.97,63.5 151.13,63.5 EXP1.B11
![W1]
  Top 0.305: P15.8 140.97,60.96 151.13,60.96 EXP1.B12
!ENDEXT
  Top 0.305: P15.3 140.97,73.66 151.13,73.66 EXP1.B7
!HALT
  Bottom 0.305: P9.1 147.32,44.45 148.59,45.72 153.67,45.72 EXP1.A19
!IO
  Bottom 0.305: P26.2 136.53,57.15 137.79,55.88 147.32,55.88 148.59,57.15 EXP1.C14
!IODEV1XX
  Top 0.305: P16.5 140.97,30.48 151.13,30.48 EXP1.B24
!IODEV2XX
  Top 0.305: P16.6 140.97,27.94 151.13,27.94 EXP1.B25
!IODEV3XX
  Top 0.305: P16.7 140.97,25.4 151.13,25.4 EXP1.B26
!IRQ
  Bottom 0.305: P31.1 136.53,19.05 137.79,17.78 147.32,17.78 148.59,19.05 EXP1.C29
!IRQ0
  Bottom 0.305: P28.1 136.53,46.99 137.79,45.72 147.32,45.72 148.59,46.99 EXP1.C18
!IRQ1
  Bottom 0.305: P29.1 136.53,44.45 137.79,43.18 147.32,43.18 148.59,44.45 EXP1.C19
!IRQ2
  Bottom 0.305: P25.1 136.53,41.91 137.79,40.64 147.32,40.64 148.59,41.91 EXP1.C20
!IRQ3
  Bottom 0.305: P6.1 147.32,59.69 148.59,60.96 153.67,60.96 EXP1.A13
!IRQ4
  Bottom 0.305: P6.2 147.32,57.15 148.59,58.42 153.67,58.42 EXP1.A14
!IRQ5
  Bottom 0.305: P6.3 147.32,54.61 148.59,55.88 153.67,55.88 EXP1.A15
!IRQ6
  Bottom 0.305: P6.4 147.32,52.07 148.59,53.34 153.67,53.34 EXP1.A16
!IRQ7
  Bottom 0.305: P8.1 147.32,46.99 148.59,48.26 153.67,48.26 EXP1.A18
!IRQS
  Bottom 0.305: P12.1 147.32,16.51 148.59,17.78 153.67,17.78 EXP1.A30
!MEM
  Bottom 0.305: P26.1 136.53,59.69 137.79,58.42 147.32,58.42 148.59,59.69 EXP1.C13
!R
  Bottom 0.305: P26.3 136.53,54.61 137.79,53.34 147.32,53.34 148.59,54.61 EXP1.C15
!RESET
  Bottom 0.305: P32.1 136.53,16.51 137.79,15.24 147.32,15.24 148.59,16.51 EXP1.C30
!RSTHOLD
  Top 0.305: P16.3 140.97,35.56 151.13,35.56 EXP1.B22
!SKIPEXT
  Top 0.305: P15.2 140.97,76.2 151.13,76.2 EXP1.B6
!SYSDEV
  Bottom 0.305: P10.1 147.32,21.59 148.59,22.86 153.67,22.86 EXP1.A28
!T34
  Top 0.305: P16.8 140.97,22.86 151.13,22.86 EXP1.B27
!W
  Bottom 0.305: P26.4 136.53,52.07 137.79,50.8 147.32,50.8 148.59,52.07 EXP1.C16
!WS
  Top 0.305: P15.4 140.97,71.12 151.13,71.12 EXP1.B8
*TPA
  Bottom 0.305: P7.1 147.32,49.53 148.59,50.8 153.67,50.8 EXP1.A17
*TPC
  Bottom 0.305: P27.1 136.53,49.53 137.79,48.26 147.32,48.26 148.59,49.53 EXP1.C17
+3.3V
  Top 1.016: EXP1.C4 EXP1.B4 EXP1.A4
  Top 1.27: P14.1 P14.2 P14.3 P14.4 P14.5 P14.6 P14.7 P14.8 EXP1.C4
+12V
  Top 1.016: EXP1.A31 EXP1.B31 EXP1.C31 P13.8 P13.7 P13.6 P13.5 P13.4 P13.3 P13.2 P13.1
AB0
  Bottom 0.305: P4.1 147.32,80.01 148.59,81.28 153.67,81.28 EXP1.A5
AB1
  Bottom 0.305: P4.2 147.32,77.47 148.59,78.74 153.67,78.74 EXP1.A6
AB2
  Bottom 0.305: P4.3 147.32,74.93 148.59,76.2 153.67,76.2 EXP1.A7
AB3
  Bottom 0.305: P4.4 147.32,72.39 148.59,73.66 153.67,73.66 EXP1.A8
AB4
  Bottom 0.305: P4.5 147.32,69.85 148.59,71.12 153.67,71.12 EXP1.A9
AB5
  Bottom 0.305: P4.6 147.32,67.31 148.59,68.58 153.67,68.58 EXP1.A10
AB6
  Bottom 0.305: P4.7 147.32,64.77 148.59,66.04 153.67,66.04 EXP1.A11
AB7
  Bottom 0.305: P4.8 147.32,62.23 148.59,63.5 153.67,63.5 EXP1.A12
AB8
  Bottom 0.305: P5.1 147.32,41.91 148.59,43.18 153.67,43.18 EXP1.A20
AB9
  Bottom 0.305: P5.2 147.32,39.37 148.59,40.64 153.67,40.64 EXP1.A21
AB10
  Bottom 0.305: P5.3 147.32,36.83 148.59,38.1 153.67,38.1 EXP1.A22
AB11
  Bottom 0.305: P5.4 147.32,34.29 148.59,35.56 153.67,35.56 EXP1.A23
AB12
  Bottom 0.305: P5.5 147.32,31.75 148.59,33.02 153.67,33.02 EXP1.A24
AB13
  Bottom 0.305: P5.6 147.32,29.21 148.59,30.48 153.67,30.48 EXP1.A25
AB14
  Bottom 0.305: P5.7 147.32,26.67 148.59,27.94 153.67,27.94 EXP1.A26
AB15
  Bottom 0.305: P5.8 147.32,24.13 148.59,25.4 153.67,25.4 EXP1.A27
AEXT0
  Top 0.305: P17.1 140.97,58.42 151.13,58.42 EXP1.B13
AEXT1
  Top 0.305: P17.2 140.97,55.88 151.13,55.88 EXP1.B14
AEXT2
  Top 0.305: P17.3 140.97,53.34 151.13,53.34 EXP1.B15
AEXT3
  Top 0.305: P17.4 140.97,50.8 151.13,50.8 EXP1.B16
AEXT4
  Top 0.305: P18.1 140.97,48.26 151.13,48.26 EXP1.B17
AEXT5
  Top 0.305: P19.1 140.97,45.72 151.13,45.72 EXP1.B18
AEXT6
  Top 0.305: P20.1 140.97,43.18 151.13,43.18 EXP1.B19
AEXT7
  Top 0.305: P16.1 140.97,40.64 151.13,40.64 EXP1.B20
B5
  Top 0.305: P15.1 140.97,78.74 151.13,78.74 EXP1.B5
B21
  Top 0.305: P16.2 140.97,38.1 151.13,38.1 EXP1.B21
B23
  Top 0.305: P16.4 140.97,33.02 151.13,33.02 EXP1.B23
CLK1
  Bottom 0.305: P11.1 147.32,19.05 148.59,20.32 153.67,20.32 EXP1.A29
CLK2
  Top 0.305: P22.1 140.97,17.78 151.13,17.78 EXP1.B29
CLK3
  Top 0.305: P23.1 140.97,15.24 151.13,15.24 EXP1.B30
CLK4
  Top 0.305: P21.1 140.97,20.32 151.13,20.32 EXP1.B28
DB0
  Bottom 0.305: EXP1.C5 148.59,80.01 147.32,78.74 138.43,78.74 137.16,80.01 P24.1
DB1
  Bottom 0.305: P24.2 136.53,77.47 137.79,76.2 147.32,76.2 148.59,77.47 EXP1.C6
DB2
  Bottom 0.305: P24.3 136.53,74.93 137.79,73.66 147.32,73.66 148.59,74.93 EXP1.C7
DB3
  Bottom 0.305: P24.4 136.53,72.39 137.79,71.12 147.32,71.12 148.59,72.39 EXP1.C8
DB4
  Bottom 0.305: P24.5 136.53,69.85 137.79,68.58 147.32,68.58 148.59,69.85 EXP1.C9
DB5
  Bottom 0.305: P24.6 136.53,67.31 137.79,66.04 147.32,66.04 148.59,67.31 EXP1.C10
DB6
  Bottom 0.305: P24.7 136.53,64.77 137.79,63.5 147.32,63.5 148.59,64.77 EXP1.C11
DB7
  Bottom 0.305: P24.8 136.53,62.23 137.79,60.96 147.32,60.96 148.59,62.23 EXP1.C12
DB8
  Bottom 0.305: P25.2 136.53,39.37 137.79,38.1 147.32,38.1 148.59,39.37 EXP1.C21
DB9
  Bottom 0.305: P25.3 136.53,36.83 137.79,35.56 147.32,35.56 148.59,36.83 EXP1.C22
DB10
  Bottom 0.305: P25.4 136.53,34.29 137.79,33.02 147.32,33.02 148.59,34.29 EXP1.C23
DB11
  Bottom 0.305: P25.5 136.53,31.75 137.79,30.48 147.32,30.48 148.59,31.75 EXP1.C24
DB12
  Bottom 0.305: P25.6 136.53,29.21 137.79,27.94 147.32,27.94 148.59,29.21 EXP1.C25
DB13
  Bottom 0.305: P25.7 136.53,26.67 137.79,25.4 147.32,25.4 148.59,26.67 EXP1.C26
DB14
  Bottom 0.305: P25.8 136.53,24.13 137.79,22.86 147.32,22.86 148.59,24.13 EXP1.C27
DB15
  Bottom 0.305: P30.1 136.53,21.59 137.79,20.32 147.32,20.32 148.59,21.59 EXP1.C28
GND  (via drill 0.41)
  Top 0.61: LED8.C v8.89,17.14 | LED7.C v8.89,20.95 | LED6.C v8.89,24.77 | LED5.C v8.89,28.57 | LED4.C v8.89,32.38 | LED3.C v8.89,36.2 | LED2.C v8.89,43.82 | LED1.C v8.89,40.01 | IC4.3 11.75,80.96 v11.43,80.64 | IC1.3 11.75,71.44 v11.43,71.12 | IC8.3 80.96,6.67 P270.5 | IC7.3 88.58,6.67 P270.8 | IC3.3 96.2,6.67 P271.3 | IC2.3 103.82,6.67 P271.6
  pour Bottom (isolate 0.305, rank 6, no thermals): 0,101.6 160.66,101.6 160.66,0.64 0,0.64
  pour Top (no thermals): 115.57,10.16 115.57,8.89 114.3,7.62 113.67,6.98 113.67,6.35 114.3,5.71 116.84,5.71 117.47,6.35 117.47,10.16
N$1
  Top 0.61: S2.4 11.99,74.37 12.7,73.66 IC1.2
  Bottom 0.61: S2.4 8.26,72.75 R1.1 6.5,71.97 C1.2
  pour Bottom (isolate 0.254, no thermals): 10.16,74.3 10.16,67.94 7.62,67.94 7.62,68.58 8.26,69.21 8.26,73.02 9.53,74.3
N$2
  Top 0.61: R10.2 PAD1.1
N$3
  Top 0.61: IC4.4 11.75,77.15 PAD9.1
N$4
  Top 0.61: IC1.4 11.75,68.26 PAD10.1
N$16
  Top 0.254: PAD16.1 102.87,12.06 102.87,10.16 101.92,9.21 IC2.1
N$17
  Top 0.254: IC2.2 102.87,8.89 103.5,9.53 104.78,9.53 105.41,10.16 105.41,12.06 PAD17.1
N$18
  Top 0.254: IC2.4 103.82,13.01 PAD18.1
N$19
  Top 0.254: IC3.1 94.3,9.21 95.25,10.16 95.25,12.06 PAD24.1
N$20
  Top 0.254: IC3.2 95.25,8.89 95.89,9.53 97.16,9.53 97.79,10.16 97.79,12.06 PAD25.1
N$21
  Top 0.254: IC3.4 96.2,13.01 PAD26.1
N$22
  pour Top (isolate 0.406, no thermals): 120.65,8.26 129.54,8.26 129.54,9.53 128.27,10.79 120.65,10.79
N$23
  pour Top (isolate 0.406, no thermals): 121.28,19.68 121.28,13.33 114.3,13.33 111.76,10.79 110.49,10.79 110.49,19.68
N$28
  Top 0.254: PAD33.1 87.63,12.06 87.63,10.16 86.68,9.21 IC7.1
N$29
  Top 0.254: IC7.2 87.63,8.89 88.27,9.53 89.53,9.53 90.17,10.16 90.17,12.06 PAD34.1
N$30
  Top 0.254: IC7.4 88.58,13.01 PAD35.1
N$31
  Top 0.254: IC8.1 79.06,9.21 80.01,10.16 80.01,12.06 PAD36.1
N$32
  Top 0.254: IC8.2 80.01,8.89 80.64,9.53 81.92,9.53 82.55,10.16 82.55,12.06 PAD37.1
N$33
  Top 0.61: S1.4 11.99,83.9 12.7,83.19 IC4.2
  Bottom 0.61: S1.4 8.26,82.27 R9.1 6.5,81.49 C13.2
  pour Bottom (isolate 0.254, no thermals): 10.16,83.82 10.16,77.47 7.62,77.47 7.62,78.1 8.26,78.74 8.26,82.55 9.53,83.82
N$34
  Top 0.254: IC8.4 80.96,13.01 PAD38.1
POWERLED
  Top 0.61: LED2.A 5.3,45.52 R10.1
POWERLED1
  Top 0.61: LED1.A 5.3,41.71 R2.1
POWERLED2
  Top 0.61: LED3.A 5.3,37.9 R3.1
POWERLED3
  Top 0.61: LED4.A 5.3,34.09 R4.1
POWERLED4
  Top 0.61: LED5.A 5.3,30.28 R5.1
POWERLED5
  Top 0.61: LED6.A 5.3,26.47 R6.1
POWERLED6
  Top 0.61: LED7.A 5.3,22.66 R7.1
POWERLED7
  Top 0.61: LED8.A 5.3,18.85 R8.1
POWEROK1
  Top 0.61: R2.2 PAD2.1
POWEROK2
  Top 0.61: R3.2 PAD3.1
POWEROK3
  Top 0.61: R4.2 PAD4.1
POWEROK4
  Top 0.61: R5.2 PAD5.1
POWEROK5
  Top 0.61: R6.2 PAD6.1
POWEROK6
  Top 0.61: R7.2 PAD7.1
POWEROK7
  Top 0.61: R8.2 PAD8.1
VCC  (via drill 0.41)
  Bottom 0.61: R9.2 8.26,78.74 7.62,78.1 v7.62,77.47 | R1.2 8.26,69.21 7.62,68.58 v7.62,67.94
  Bottom 1.016: C2.1 23.13,77.47 P40.1 | C3.1 38.37,77.47 P41.1 | C7.1 56.15,77.47 P42.1 | C4.1 73.93,77.47 P63.1 | C6.1 91.71,77.47 P64.1 | C5.1 109.49,77.47 P66.1 | C25.1 109.49,64.77 P132.1 | C28.1 91.71,64.77 P131.1 | C31.1 73.93,64.77 P130.1 | C34.1 56.15,64.77 P129.1 | C23.1 109.49,52.07 P39.1 | C21.1 91.71,52.07 P65.1 | C19.1 73.93,52.07 P67.1 | C17.1 56.15,52.07 P68.1 | C11.1 38.37,52.07 P69.1 | C9.1 23.13,52.07 P70.1 | C35.1 56.15,39.37 P159.1 | C32.1 73.93,39.37 P186.1 | C29.1 91.71,39.37 P187.1 | C26.1 109.49,39.37 P188.1 | C8.1 23.13,26.67 P33.1 | C10.1 38.37,26.67 P34.1 | C12.1 56.15,26.67 P35.1 | C18.1 73.93,26.67 P36.1 | C20.1 91.71,26.67 P37.1 | C22.1 109.49,26.67 P38.1
  pour Top (isolate 0.305, rank 6, no thermals): 0,101.6 160.66,101.6 160.66,0.64 0,0.64

## Text on the board
tNames: C | B | A | 3.3V | 5 | 5V | 0V | 10 | 5V | 0V | 15 | 5V | 0V | 1 | 20 | 5V | 2 | 0V | 3 | 4 | 5 | 25 | 5V | 6 | 0V | 7 | 8 | Vout | LDO | 30 | 12V | A | Y | B | Reg | Vin | 1 | 2 | 3 | 4 | (c) 2013 AlexiosC | 1337 | CFT Minicomputer Prototyping Board Rev A
bNames: CFT Minicomputer Prototyping Board Rev A | 1 | C | B | A | 3.3V | 5 | 5 | 10 | 10 | 15 | 15 | 20 | 20 | 25 | 25 | 1337 | 30 | 30 | 12V | 32 | http://www.bedroomlan.org/cft | (c) 2013 AlexiosC